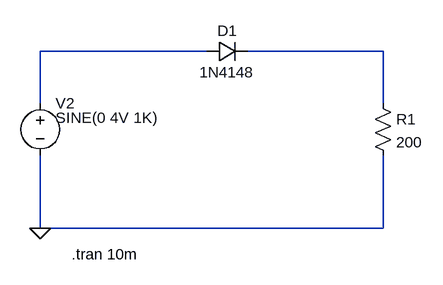
[diagram p0: schematic 4-6.asc]
4-6.asc, the LTspice schematic file:
Version 4
SHEET 1 880 680
WIRE 528 176 272 176
WIRE 800 176 592 176
WIRE 272 256 272 176
WIRE 800 256 800 176
WIRE 272 448 272 336
WIRE 800 448 800 336
WIRE 800 448 272 448
FLAG 272 448 0
SYMBOL Voltage 272 240 R0
WINDOW 3 24 38 Left 2
SYMATTR InstName V2
SYMATTR Value SINE(0 4V 1K)
SYMBOL diode 528 192 R270
WINDOW 0 32 32 VTop 2
WINDOW 3 0 32 VBottom 2
SYMATTR InstName D1
SYMATTR Value 1N4148
SYMBOL Res 784 240 R0
SYMATTR InstName R1
SYMATTR Value 200
TEXT 320 488 Left 2 !.tran 10m

The netlist it stands for:
* 4-6.asc
V2 N001 0 SINE(0 4V 1K)
D1 N001 N002 1N4148
R1 N002 0 200
.model D D
.lib standard.dio
.tran 10m
.backanno
.end